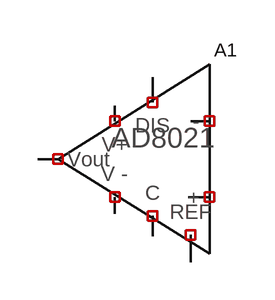
[diagram p0: schematic Draft3.asc]
Draft3.asc, the LTspice schematic file:
Version 4
SHEET 1 880 680
SYMBOL AD8021 208 160 R0
SYMATTR SpiceModel ""
SYMATTR InstName A1
SYMATTR Value -

The netlist it stands for:
* Draft3.asc
A1 0 0 0 0 0 0 0 0 -
.backanno
.end